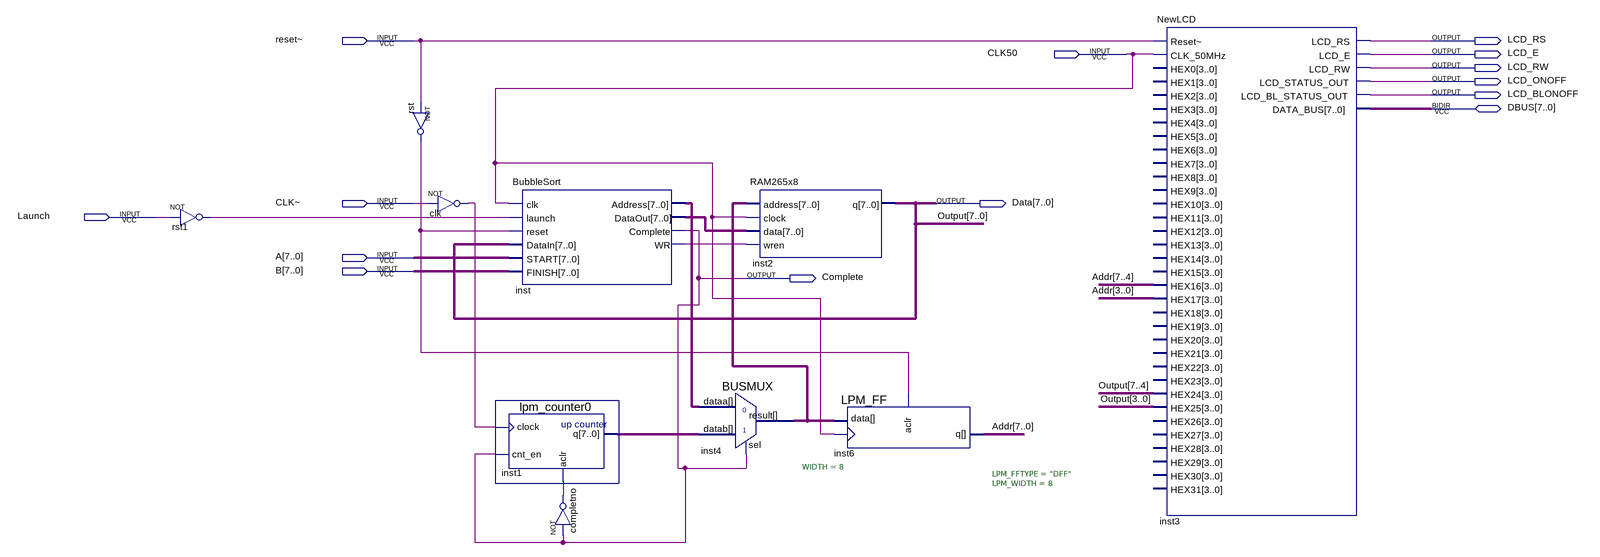
[diagram p0: schematic sheet]
// Quartus schematic Sorterbdf.bdf as structural Verilog: 10 symbols, 14 pins
module Sorterbdf (
  input  \reset~ ,
  input  CLK50,
  input  \CLK~ ,
  input  Launch,
  input  [7:0] A,
  input  [7:0] B,
  inout  [7:0] DBUS,
  output LCD_RS,
  output LCD_E,
  output LCD_RW,
  output LCD_ONOFF,
  output LCD_BLONOFF,
  output [7:0] Data,
  output Complete
);

  wire clk_out, completno_out, inst_wr, rst1_out, rst_out;
  wire [7:0] Addr, inst1_q, inst4_result, inst_address, inst_dataout;

  not rst1 (rst1_out, Launch);
  not rst (rst_out, \reset~ );
  not clk (clk_out, \CLK~ );
  BubbleSort inst (
    .clk(CLK50), .launch(rst1_out), .reset(rst_out), .DataIn(Data), .START(A), .FINISH(B),
    .Address(inst_address), .DataOut(inst_dataout), .Complete(Complete), .WR(inst_wr));
  lpm_counter0 inst1 (.clock(clk_out), .cnt_en(Complete), .aclr(completno_out), .q(inst1_q));
  not completno (completno_out, Complete);
  BUSMUX #(.WIDTH(8)) inst4 (.datab(inst1_q), .sel(Complete), .dataa(inst_address), .result(inst4_result));
  RAM265x8 inst2 (.address(inst4_result), .clock(CLK50), .data(inst_dataout), .wren(inst_wr), .q(Data));
  LPM_FF #(.LPM_FFTYPE("DFF"), .LPM_WIDTH(8)) inst6 (.clock(CLK50), .aclr(rst_out), .data(inst4_result), .q(Addr));
  NewLCD inst3 (
    .\Reset~ (\reset~ ), .CLK_50MHz(CLK50), .HEX16(Addr[7:4]), .HEX17(Addr[3:0]), .HEX24(Data[7:4]),
    .HEX25(Data[3:0]), .LCD_RS(LCD_RS), .LCD_E(LCD_E), .LCD_RW(LCD_RW), .LCD_STATUS_OUT(LCD_ONOFF),
    .LCD_BL_STATUS_OUT(LCD_BLONOFF), .DATA_BUS(DBUS));  // open: HEX0, HEX1, HEX2, HEX3, HEX4, HEX5, HEX6, HEX7, HEX8, HEX9, HEX10, HEX11, HEX12, HEX13, HEX14, HEX15, HEX18, HEX19, HEX20, HEX21, HEX22, HEX23, HEX26, HEX27, HEX28, HEX29, HEX30, HEX31

  // Other names for the same wires on the sheet: Output[7:0] = Data
endmodule
